# Altium schematic sheet [04] - DOC REVISION HISTORY.SchDoc
size A3; DocumentNumber: 4; SheetNumber: 4; SheetTotal: 4; Organization: Altium Limited; Address1: L3, 12a Rodborough Rd; Address2: Frenchs Forest; Address3: NSW; Address4: Australia 2086
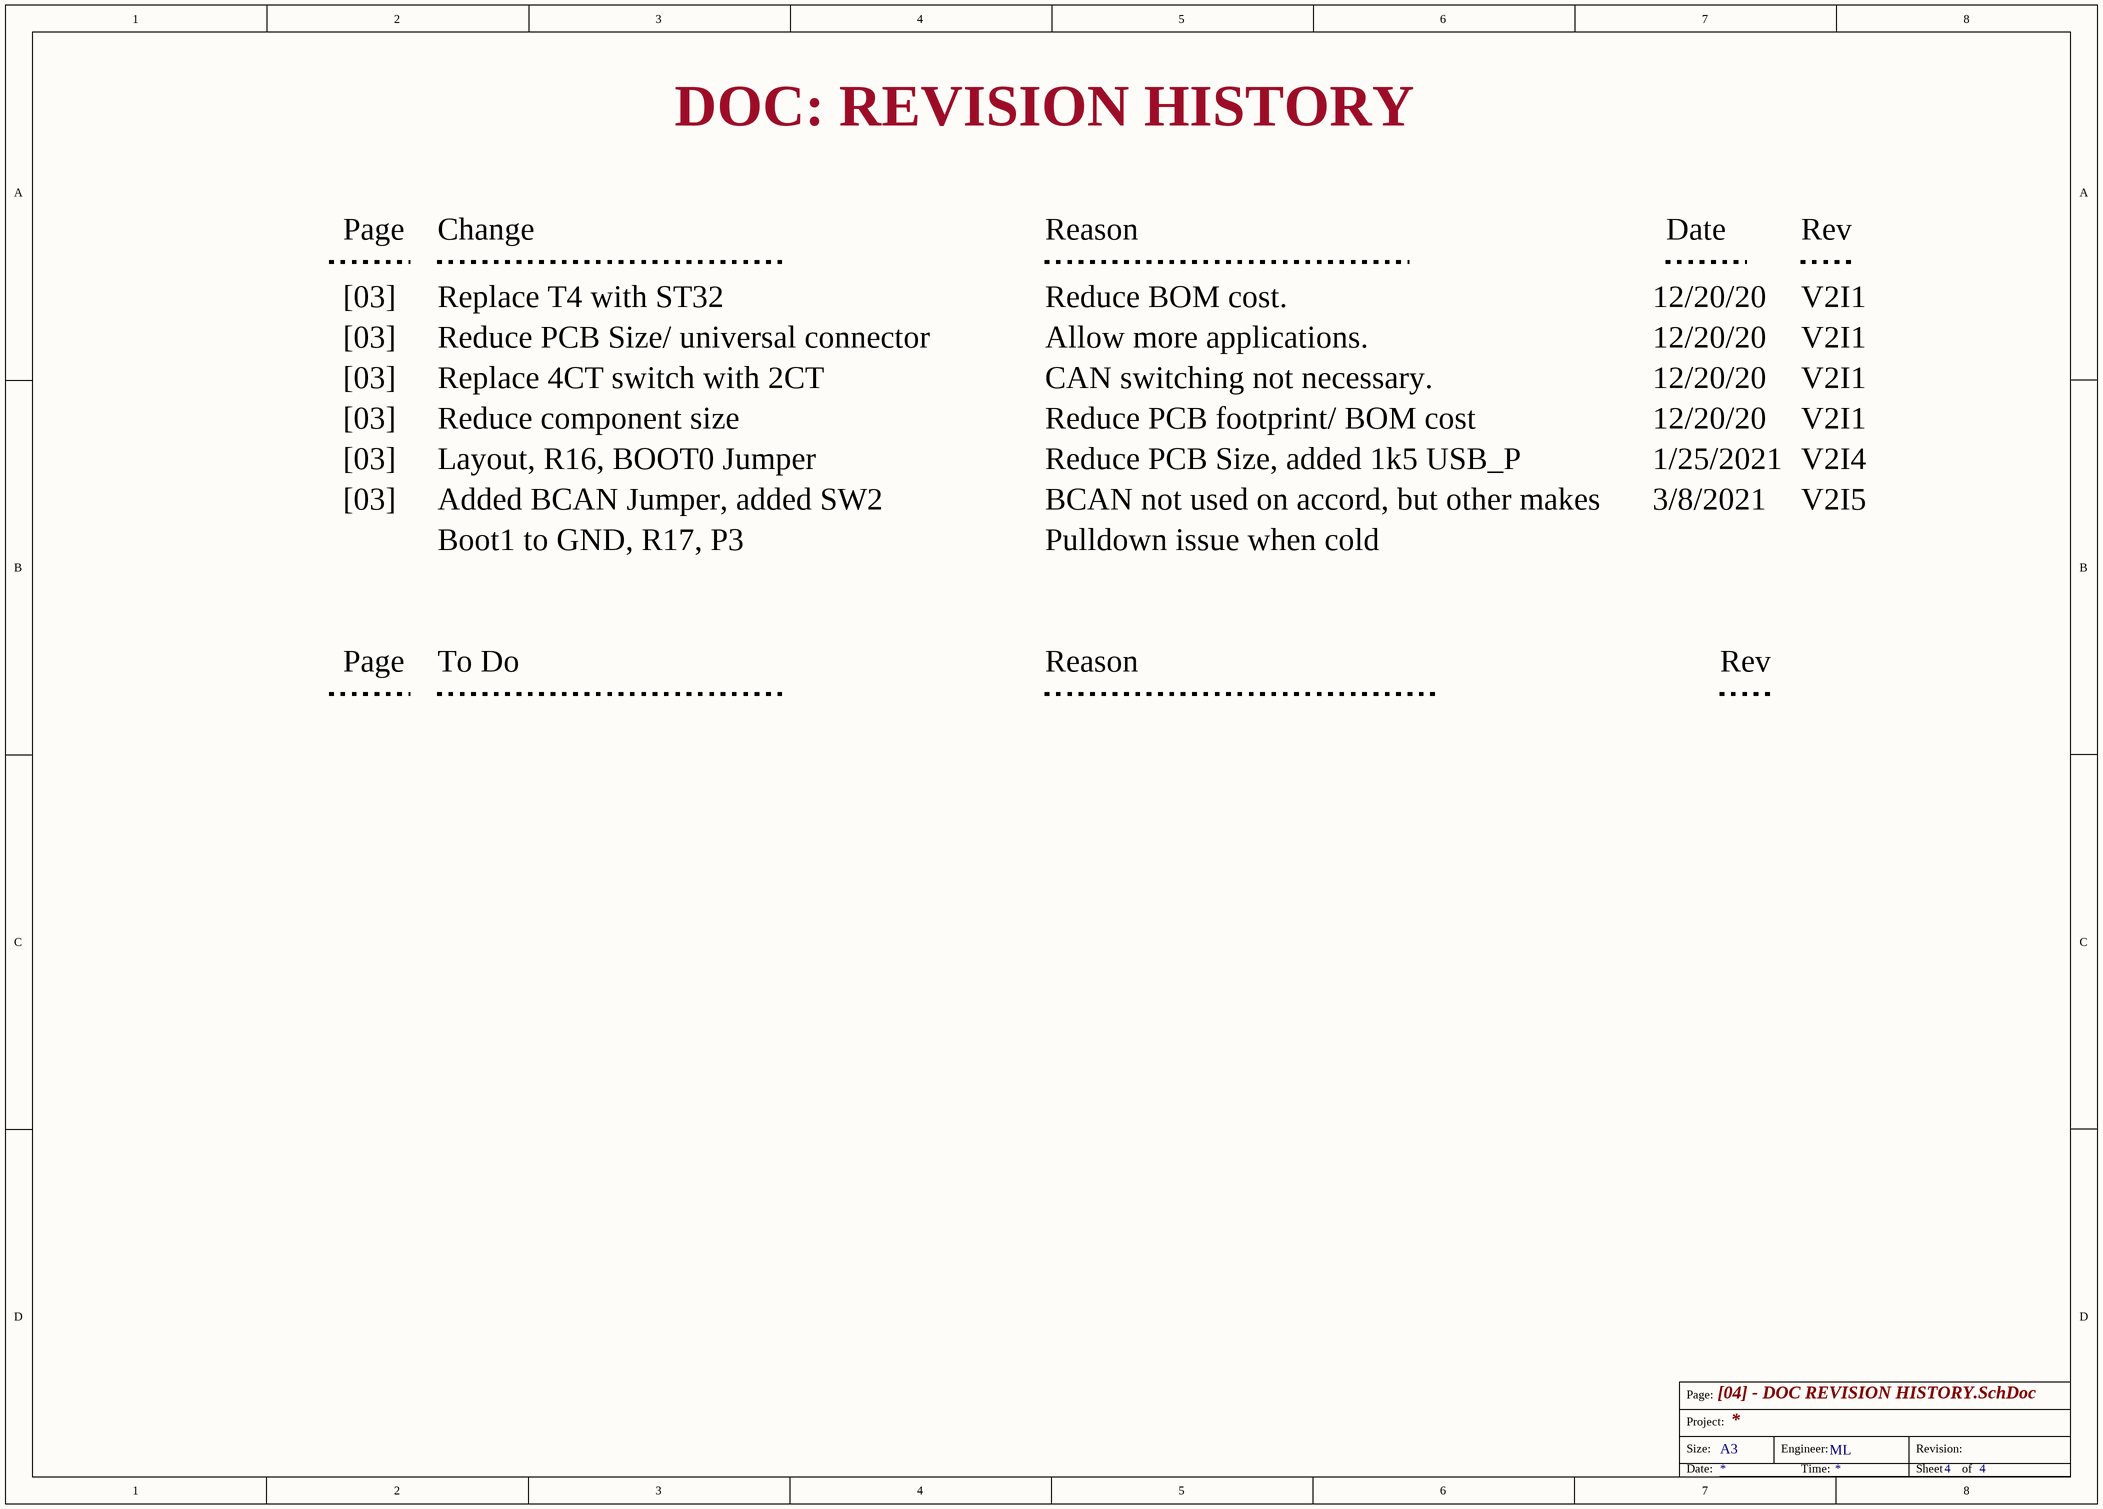
[diagram p0: [04] - DOC REVISION HISTORY.SchDoc]

## Notes on the sheet
- DOC: REVISION HISTORY
- Page
- Change
- Reason
- Date
- Rev
- [03]
- Replace T4 with ST32
- Reduce BOM cost.
- 12/20/20
- V2I1
- Reduce PCB Size/ universal connector
- Allow more applications.
- Replace 4CT switch with 2CT
- Reduce component size
- CAN switching not necessary.
- Reduce PCB footprint/ BOM cost
- Layout, R16, BOOT0 Jumper
- Added BCAN Jumper, added SW2
- Reduce PCB Size, added 1k5 USB_P
- BCAN not used on accord, but other makes
- 1/25/2021
- 3/8/2021
- V2I4
- V2I5
- Boot1 to GND, R17, P3
- Pulldown issue when cold
- To Do
- CLOCKS (CPU & PCIE)
- Page:
- Size:
- Project:
- A3
- Engineer:
- ML
- Revision:
- Date:
- Time:
- Sheet
- of